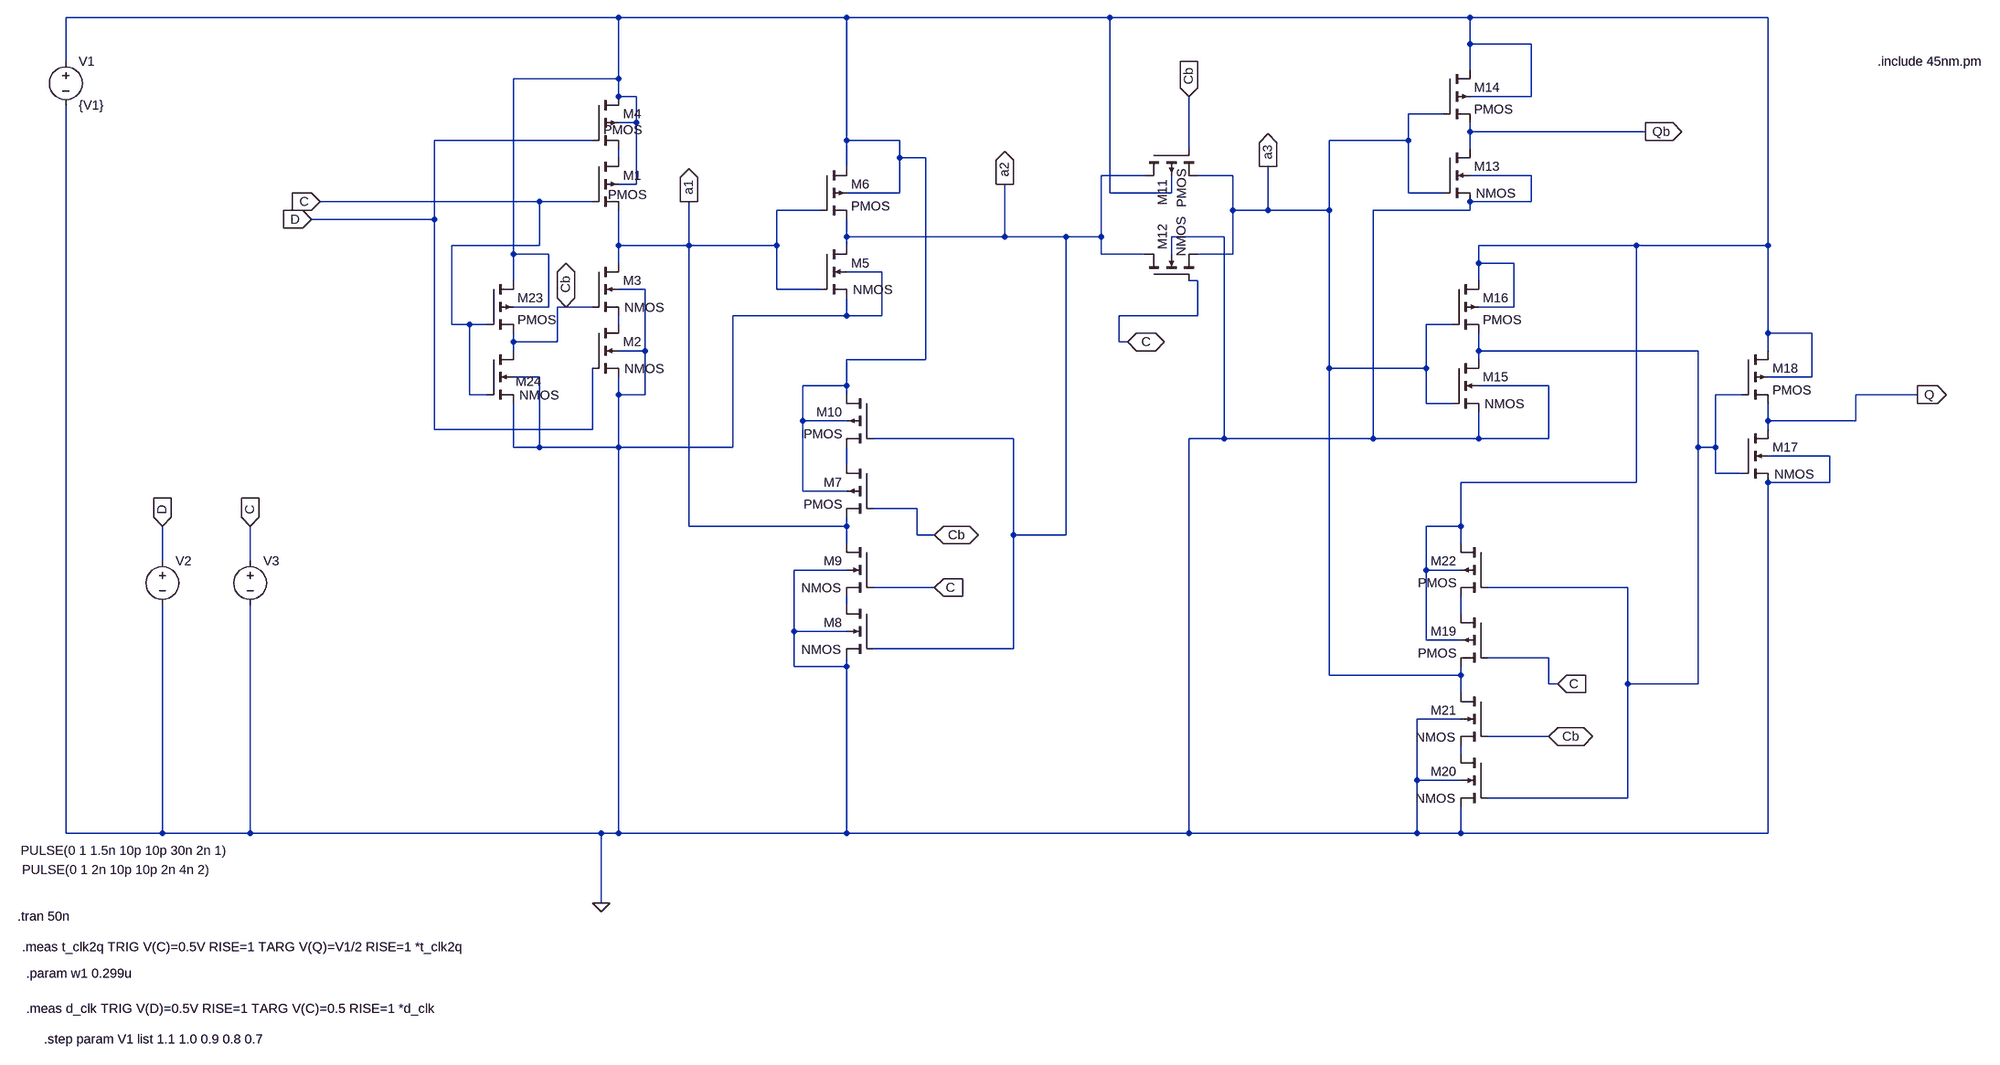
[diagram p0: schematic new1-q2.asc]
new1-q2.asc, the LTspice schematic file:
Version 4
SHEET 1 1192 1016
WIRE -1312 -864 -2320 -864
WIRE -896 -864 -1312 -864
WIRE -416 -864 -896 -864
WIRE 240 -864 -416 -864
WIRE 784 -864 240 -864
WIRE 240 -816 240 -864
WIRE 352 -816 240 -816
WIRE -2320 -784 -2320 -864
WIRE 240 -768 240 -816
WIRE -1312 -752 -1312 -864
WIRE -1312 -752 -1504 -752
WIRE -1312 -720 -1312 -752
WIRE -1280 -720 -1312 -720
WIRE 352 -720 352 -816
WIRE 352 -720 240 -720
WIRE 192 -688 128 -688
WIRE -1280 -672 -1280 -720
WIRE -1280 -672 -1312 -672
WIRE 240 -656 240 -672
WIRE 560 -656 240 -656
WIRE -1360 -640 -1648 -640
WIRE -896 -640 -896 -864
WIRE -800 -640 -896 -640
WIRE 128 -640 128 -688
WIRE 128 -640 -16 -640
WIRE -272 -624 -272 -720
WIRE 240 -624 240 -656
WIRE -1312 -608 -1312 -624
WIRE -800 -608 -800 -640
WIRE -752 -608 -800 -608
WIRE -896 -592 -896 -640
WIRE -352 -576 -432 -576
WIRE -192 -576 -256 -576
WIRE 352 -576 240 -576
WIRE -1280 -560 -1280 -672
WIRE -1280 -560 -1312 -560
WIRE -800 -544 -800 -608
WIRE -800 -544 -896 -544
WIRE -416 -544 -416 -864
WIRE -304 -544 -304 -576
WIRE -304 -544 -416 -544
WIRE 128 -544 128 -640
WIRE 192 -544 128 -544
WIRE -1456 -528 -1856 -528
WIRE -1360 -528 -1456 -528
WIRE 352 -528 352 -576
WIRE 352 -528 240 -528
WIRE -944 -512 -1024 -512
WIRE -192 -512 -192 -576
WIRE -128 -512 -128 -592
WIRE -128 -512 -192 -512
WIRE -16 -512 -16 -640
WIRE -16 -512 -128 -512
WIRE 240 -512 240 -528
WIRE 240 -512 64 -512
WIRE -1648 -496 -1648 -640
WIRE -1648 -496 -1872 -496
WIRE -896 -464 -896 -496
WIRE -608 -464 -608 -560
WIRE -608 -464 -896 -464
WIRE -496 -464 -608 -464
WIRE -432 -464 -432 -576
WIRE -432 -464 -496 -464
WIRE -208 -464 -304 -464
WIRE -1456 -448 -1456 -528
WIRE -1456 -448 -1616 -448
WIRE -1312 -448 -1312 -512
WIRE -1184 -448 -1184 -528
WIRE -1184 -448 -1312 -448
WIRE -1024 -448 -1024 -512
WIRE -1024 -448 -1184 -448
WIRE -896 -448 -896 -464
WIRE 544 -448 256 -448
WIRE 784 -448 784 -864
WIRE 784 -448 544 -448
WIRE -1504 -432 -1504 -752
WIRE -1440 -432 -1504 -432
WIRE -432 -432 -432 -464
WIRE -352 -432 -432 -432
WIRE -304 -432 -304 -464
WIRE -192 -432 -192 -512
WIRE -192 -432 -256 -432
WIRE -1312 -416 -1312 -448
WIRE 256 -416 256 -448
WIRE 320 -416 256 -416
WIRE -832 -400 -896 -400
WIRE -1504 -384 -1504 -432
WIRE -256 -384 -272 -384
WIRE 256 -384 256 -416
WIRE -1264 -368 -1312 -368
WIRE -1024 -368 -1024 -448
WIRE -944 -368 -1024 -368
WIRE -1440 -336 -1440 -432
WIRE -1440 -336 -1504 -336
WIRE -1408 -336 -1424 -336
WIRE -1360 -336 -1408 -336
WIRE 320 -336 320 -416
WIRE 320 -336 256 -336
WIRE -896 -320 -896 -352
WIRE -896 -320 -1104 -320
WIRE -832 -320 -832 -400
WIRE -832 -320 -896 -320
WIRE -256 -320 -256 -384
WIRE -256 -320 -400 -320
WIRE -1616 -304 -1616 -448
WIRE -1584 -304 -1616 -304
WIRE -1552 -304 -1584 -304
WIRE -1312 -304 -1312 -320
WIRE 208 -304 160 -304
WIRE 784 -288 784 -448
WIRE 864 -288 784 -288
WIRE -1504 -272 -1504 -288
WIRE -1424 -272 -1424 -336
WIRE -1424 -272 -1504 -272
WIRE -400 -272 -400 -320
WIRE -384 -272 -400 -272
WIRE -1504 -256 -1504 -272
WIRE -1264 -256 -1264 -368
WIRE -1264 -256 -1312 -256
WIRE 256 -256 256 -288
WIRE 656 -256 256 -256
WIRE 784 -256 784 -288
WIRE -752 -240 -752 -608
WIRE -752 -240 -896 -240
WIRE 256 -240 256 -256
WIRE -16 -224 -16 -512
WIRE 160 -224 160 -304
WIRE 160 -224 -16 -224
WIRE -1456 -208 -1504 -208
WIRE 864 -208 864 -288
WIRE 864 -208 784 -208
WIRE -896 -192 -896 -240
WIRE -896 -192 -976 -192
WIRE 384 -192 256 -192
WIRE -1584 -176 -1584 -304
WIRE -1552 -176 -1584 -176
WIRE -1312 -176 -1312 -208
WIRE -1264 -176 -1264 -256
WIRE -1264 -176 -1312 -176
WIRE -896 -176 -896 -192
WIRE 736 -176 688 -176
WIRE 1056 -176 944 -176
WIRE 160 -160 160 -224
WIRE 208 -160 160 -160
WIRE -976 -128 -976 -192
WIRE -896 -128 -976 -128
WIRE 784 -128 784 -160
WIRE 944 -128 944 -176
WIRE 944 -128 784 -128
WIRE -1648 -112 -1648 -496
WIRE -1360 -112 -1360 -224
WIRE -1360 -112 -1648 -112
WIRE 784 -112 784 -128
WIRE -592 -96 -848 -96
WIRE -208 -96 -208 -464
WIRE -208 -96 -272 -96
WIRE 64 -96 64 -512
WIRE 64 -96 -208 -96
WIRE 256 -96 256 -144
WIRE 256 -96 64 -96
WIRE 384 -96 384 -192
WIRE 384 -96 256 -96
WIRE -1504 -80 -1504 -160
WIRE -1456 -80 -1456 -208
WIRE -1456 -80 -1504 -80
WIRE -1312 -80 -1312 -176
WIRE -1312 -80 -1456 -80
WIRE -1104 -80 -1104 -320
WIRE -1104 -80 -1312 -80
WIRE 656 -80 656 -256
WIRE 688 -80 688 -176
WIRE 688 -80 656 -80
WIRE 896 -64 784 -64
WIRE -896 -48 -896 -80
WIRE 688 -32 688 -80
WIRE 736 -32 688 -32
WIRE 544 -16 544 -448
WIRE 544 -16 224 -16
WIRE 896 -16 896 -64
WIRE 896 -16 784 -16
WIRE -976 0 -976 -128
WIRE -896 0 -976 0
WIRE -768 32 -848 32
WIRE -1184 64 -1184 -448
WIRE -896 64 -896 48
WIRE -896 64 -1184 64
WIRE 224 64 224 -16
WIRE 224 64 160 64
WIRE -768 80 -768 32
WIRE -736 80 -768 80
WIRE -592 80 -592 -96
WIRE -496 80 -496 -464
WIRE -496 80 -592 80
WIRE -896 96 -896 64
WIRE 224 96 224 64
WIRE -2144 128 -2144 64
WIRE -1984 128 -1984 64
WIRE -896 144 -992 144
WIRE 160 144 160 64
WIRE 224 144 160 144
WIRE -736 176 -848 176
WIRE 528 176 272 176
WIRE -896 208 -896 192
WIRE 224 224 224 192
WIRE -992 256 -992 144
WIRE -896 256 -992 256
WIRE 160 272 160 144
WIRE 224 272 160 272
WIRE -592 288 -592 80
WIRE -592 288 -848 288
WIRE 384 304 272 304
WIRE -992 320 -992 256
WIRE -896 320 -896 304
WIRE -896 320 -992 320
WIRE -16 336 -16 -224
WIRE 224 336 224 320
WIRE 224 336 -16 336
WIRE 384 352 384 304
WIRE 400 352 384 352
WIRE 528 352 528 176
WIRE 656 352 656 -80
WIRE 656 352 528 352
WIRE 224 368 224 336
WIRE 224 416 144 416
WIRE 384 448 272 448
WIRE 224 480 224 464
WIRE 144 528 144 416
WIRE 224 528 144 528
WIRE 528 560 528 352
WIRE 528 560 272 560
WIRE -2320 624 -2320 -704
WIRE -2144 624 -2144 208
WIRE -2144 624 -2320 624
WIRE -1984 624 -1984 208
WIRE -1984 624 -2144 624
WIRE -1344 624 -1984 624
WIRE -1312 624 -1312 -80
WIRE -1312 624 -1344 624
WIRE -896 624 -896 320
WIRE -896 624 -1312 624
WIRE -272 624 -272 -96
WIRE -272 624 -896 624
WIRE 144 624 144 528
WIRE 144 624 -272 624
WIRE 224 624 224 576
WIRE 224 624 144 624
WIRE 784 624 784 -16
WIRE 784 624 224 624
WIRE -1344 752 -1344 624
FLAG -1344 752 0
FLAG -1872 -496 D
IOPIN -1872 -496 In
FLAG -1856 -528 C
IOPIN -1856 -528 In
FLAG -736 176 C
IOPIN -736 176 In
FLAG 384 448 Cb
IOPIN 384 448 BiDir
FLAG -272 -720 Cb
IOPIN -272 -720 In
FLAG 1056 -176 Q
IOPIN 1056 -176 Out
FLAG 560 -656 Qb
IOPIN 560 -656 Out
FLAG -2144 64 D
IOPIN -2144 64 In
FLAG -1984 64 C
IOPIN -1984 64 In
FLAG -1184 -528 a1
IOPIN -1184 -528 Out
FLAG -608 -560 a2
IOPIN -608 -560 Out
FLAG -128 -592 a3
IOPIN -128 -592 Out
FLAG -1408 -336 Cb
IOPIN -1408 -336 BiDir
FLAG -384 -272 C
IOPIN -384 -272 BiDir
FLAG -736 80 Cb
IOPIN -736 80 BiDir
FLAG 400 352 C
IOPIN 400 352 In
SYMBOL pmos4 -1360 -608 R0
WINDOW 3 29 67 Left 2
SYMATTR InstName M1
SYMATTR Value2 l=45n w=w1
SYMBOL nmos4 -1360 -304 R0
WINDOW 3 59 81 Left 2
SYMATTR InstName M2
SYMATTR Value2 l=45n w=0.2u
SYMBOL nmos4 -1360 -416 R0
WINDOW 3 59 81 Left 2
SYMATTR InstName M3
SYMATTR Value2 l=45n w=0.2u
SYMBOL pmos4 -1360 -720 R0
WINDOW 3 20 61 Left 2
SYMATTR InstName M4
SYMATTR Value2 l=45n w=w1
SYMBOL nmos4 -944 -448 R0
WINDOW 3 59 81 Left 2
SYMATTR InstName M5
SYMATTR Value2 l=45n w=0.2u
SYMBOL pmos4 -944 -592 R0
SYMATTR InstName M6
SYMATTR Value2 l=45n w=0.4u
SYMBOL pmos4 -848 -48 M0
SYMATTR InstName M7
SYMATTR Value2 l=45n w=w1
SYMBOL nmos4 -848 208 M0
WINDOW 3 59 81 Left 2
SYMATTR InstName M8
SYMATTR Value2 l=45n w=0.2u
SYMBOL nmos4 -848 96 M0
WINDOW 3 59 81 Left 2
SYMATTR InstName M9
SYMATTR Value2 l=45n w=0.2u
SYMBOL pmos4 -848 -176 M0
SYMATTR InstName M10
SYMATTR Value2 l=45n w=w1
SYMBOL pmos4 -352 -624 M90
WINDOW 3 37 67 Left 2
SYMATTR InstName M11
SYMATTR Value2 l=45n w=0.4u
SYMBOL nmos4 -352 -384 R270
WINDOW 3 44 66 Left 2
SYMATTR InstName M12
SYMATTR Value2 l=45n w=0.2u
SYMBOL nmos4 192 -624 R0
WINDOW 3 59 81 Left 2
SYMATTR InstName M13
SYMATTR Value2 l=45n w=0.2u
SYMBOL pmos4 192 -768 R0
SYMATTR InstName M14
SYMATTR Value2 l=45n w=0.4u
SYMBOL nmos4 208 -240 R0
WINDOW 3 59 81 Left 2
SYMATTR InstName M15
SYMATTR Value2 l=45n w=0.2u
SYMBOL pmos4 208 -384 R0
SYMATTR InstName M16
SYMATTR Value2 l=45n w=0.296u
SYMBOL nmos4 736 -112 R0
WINDOW 3 59 81 Left 2
SYMATTR InstName M17
SYMATTR Value2 l=45n w=0.2u
SYMBOL pmos4 736 -256 R0
SYMATTR InstName M18
SYMATTR Value2 l=45n w=0.4u
SYMBOL pmos4 272 224 M0
SYMATTR InstName M19
SYMATTR Value2 l=45n w=w1
SYMBOL nmos4 272 480 M0
WINDOW 3 59 81 Left 2
SYMATTR InstName M20
SYMATTR Value2 l=45n w=0.2u
SYMBOL nmos4 272 368 M0
WINDOW 3 59 81 Left 2
SYMATTR InstName M21
SYMATTR Value2 l=45n w=0.2u
SYMBOL pmos4 272 96 M0
SYMATTR InstName M22
SYMATTR Value2 l=45n w=w1
SYMBOL voltage -2320 -800 R0
WINDOW 123 0 0 Left 0
WINDOW 39 0 0 Left 0
SYMATTR InstName V1
SYMATTR Value {V1}
SYMBOL voltage -2144 112 R0
WINDOW 3 -258 544 Left 2
WINDOW 123 0 0 Left 0
WINDOW 39 0 0 Left 0
SYMATTR Value PULSE(0 1 1.5n 10p 10p 30n 2n 1)
SYMATTR InstName V2
SYMBOL voltage -1984 112 R0
WINDOW 3 -416 579 Left 2
WINDOW 123 0 0 Left 0
WINDOW 39 0 0 Left 0
SYMATTR Value PULSE(0 1 2n 10p 10p 2n 4n 2)
SYMATTR InstName V3
SYMBOL pmos4 -1552 -384 R0
SYMATTR InstName M23
SYMATTR Value2 l=45n w=0.4u
SYMBOL nmos4 -1552 -256 R0
WINDOW 0 52 56 Left 2
WINDOW 3 59 81 Left 2
SYMATTR InstName M24
SYMATTR Value2 l=45n w=0.2u
TEXT 984 -784 Left 2 !.include 45nm.pm
TEXT -2408 776 Left 2 !.tran 50n
TEXT -2400 832 Left 2 !.meas t_clk2q TRIG V(C)=0.5V RISE=1 TARG V(Q)=V1/2 RISE=1 *t_clk2q
TEXT -2392 880 Left 2 !.param w1 0.299u
TEXT -2392 944 Left 2 !.meas d_clk TRIG V(D)=0.5V RISE=1 TARG V(C)=0.5 RISE=1 *d_clk
TEXT -2360 1000 Left 2 !.step param V1 list 1.1 1.0 0.9 0.8 0.7

The netlist it stands for:
* new1-q2.asc
M1 N002 C a1 N001 PMOS l=45n w=w1
M2 N003 D 0 0 NMOS l=45n w=0.2u
M3 a1 Cb N003 0 NMOS l=45n w=0.2u
M4 N001 D N002 N001 PMOS l=45n w=w1
M5 a2 a1 0 0 NMOS l=45n w=0.2u
M6 N001 a1 a2 N001 PMOS l=45n w=0.4u
M7 N005 Cb a1 N001 PMOS l=45n w=w1
M8 N006 a2 0 0 NMOS l=45n w=0.2u
M9 a1 C N006 0 NMOS l=45n w=0.2u
M10 N001 a2 N005 N001 PMOS l=45n w=w1
M11 a2 Cb a3 N001 PMOS l=45n w=0.4u
M12 a2 C a3 0 NMOS l=45n w=0.2u
M13 Qb a3 0 0 NMOS l=45n w=0.2u
M14 N001 a3 Qb N001 PMOS l=45n w=0.4u
M15 N004 a3 0 0 NMOS l=45n w=0.2u
M16 N001 a3 N004 N001 PMOS l=45n w=0.296u
M17 Q N004 0 0 NMOS l=45n w=0.2u
M18 N001 N004 Q N001 PMOS l=45n w=0.4u
M19 N007 C a3 N001 PMOS l=45n w=w1
M20 N008 N004 0 0 NMOS l=45n w=0.2u
M21 a3 Cb N008 0 NMOS l=45n w=0.2u
M22 N001 N004 N007 N001 PMOS l=45n w=w1
V1 N001 0 {V1}
V2 D 0 PULSE(0 1 1.5n 10p 10p 30n 2n 1)
V3 C 0 PULSE(0 1 2n 10p 10p 2n 4n 2)
M23 N001 C Cb N001 PMOS l=45n w=0.4u
M24 Cb C 0 0 NMOS l=45n w=0.2u
.model NMOS NMOS
.model PMOS PMOS
.lib standard.mos
.include 45nm.pm
.tran 50n
.meas t_clk2q TRIG V(C)=0.5V RISE=1 TARG V(Q)=V1/2 RISE=1 *t_clk2q
.param w1 0.299u
.meas d_clk TRIG V(D)=0.5V RISE=1 TARG V(C)=0.5 RISE=1 *d_clk
.step param V1 list 1.1 1.0 0.9 0.8 0.7
.backanno
.end